# EasyEDA schematic SCH_SnailCard.json
TITLE: Sheet_1; REV: 1.0; Date: 2021-07-12; Sheet: 1/1; Drawn By: ftwtwzy; Company: Your Company
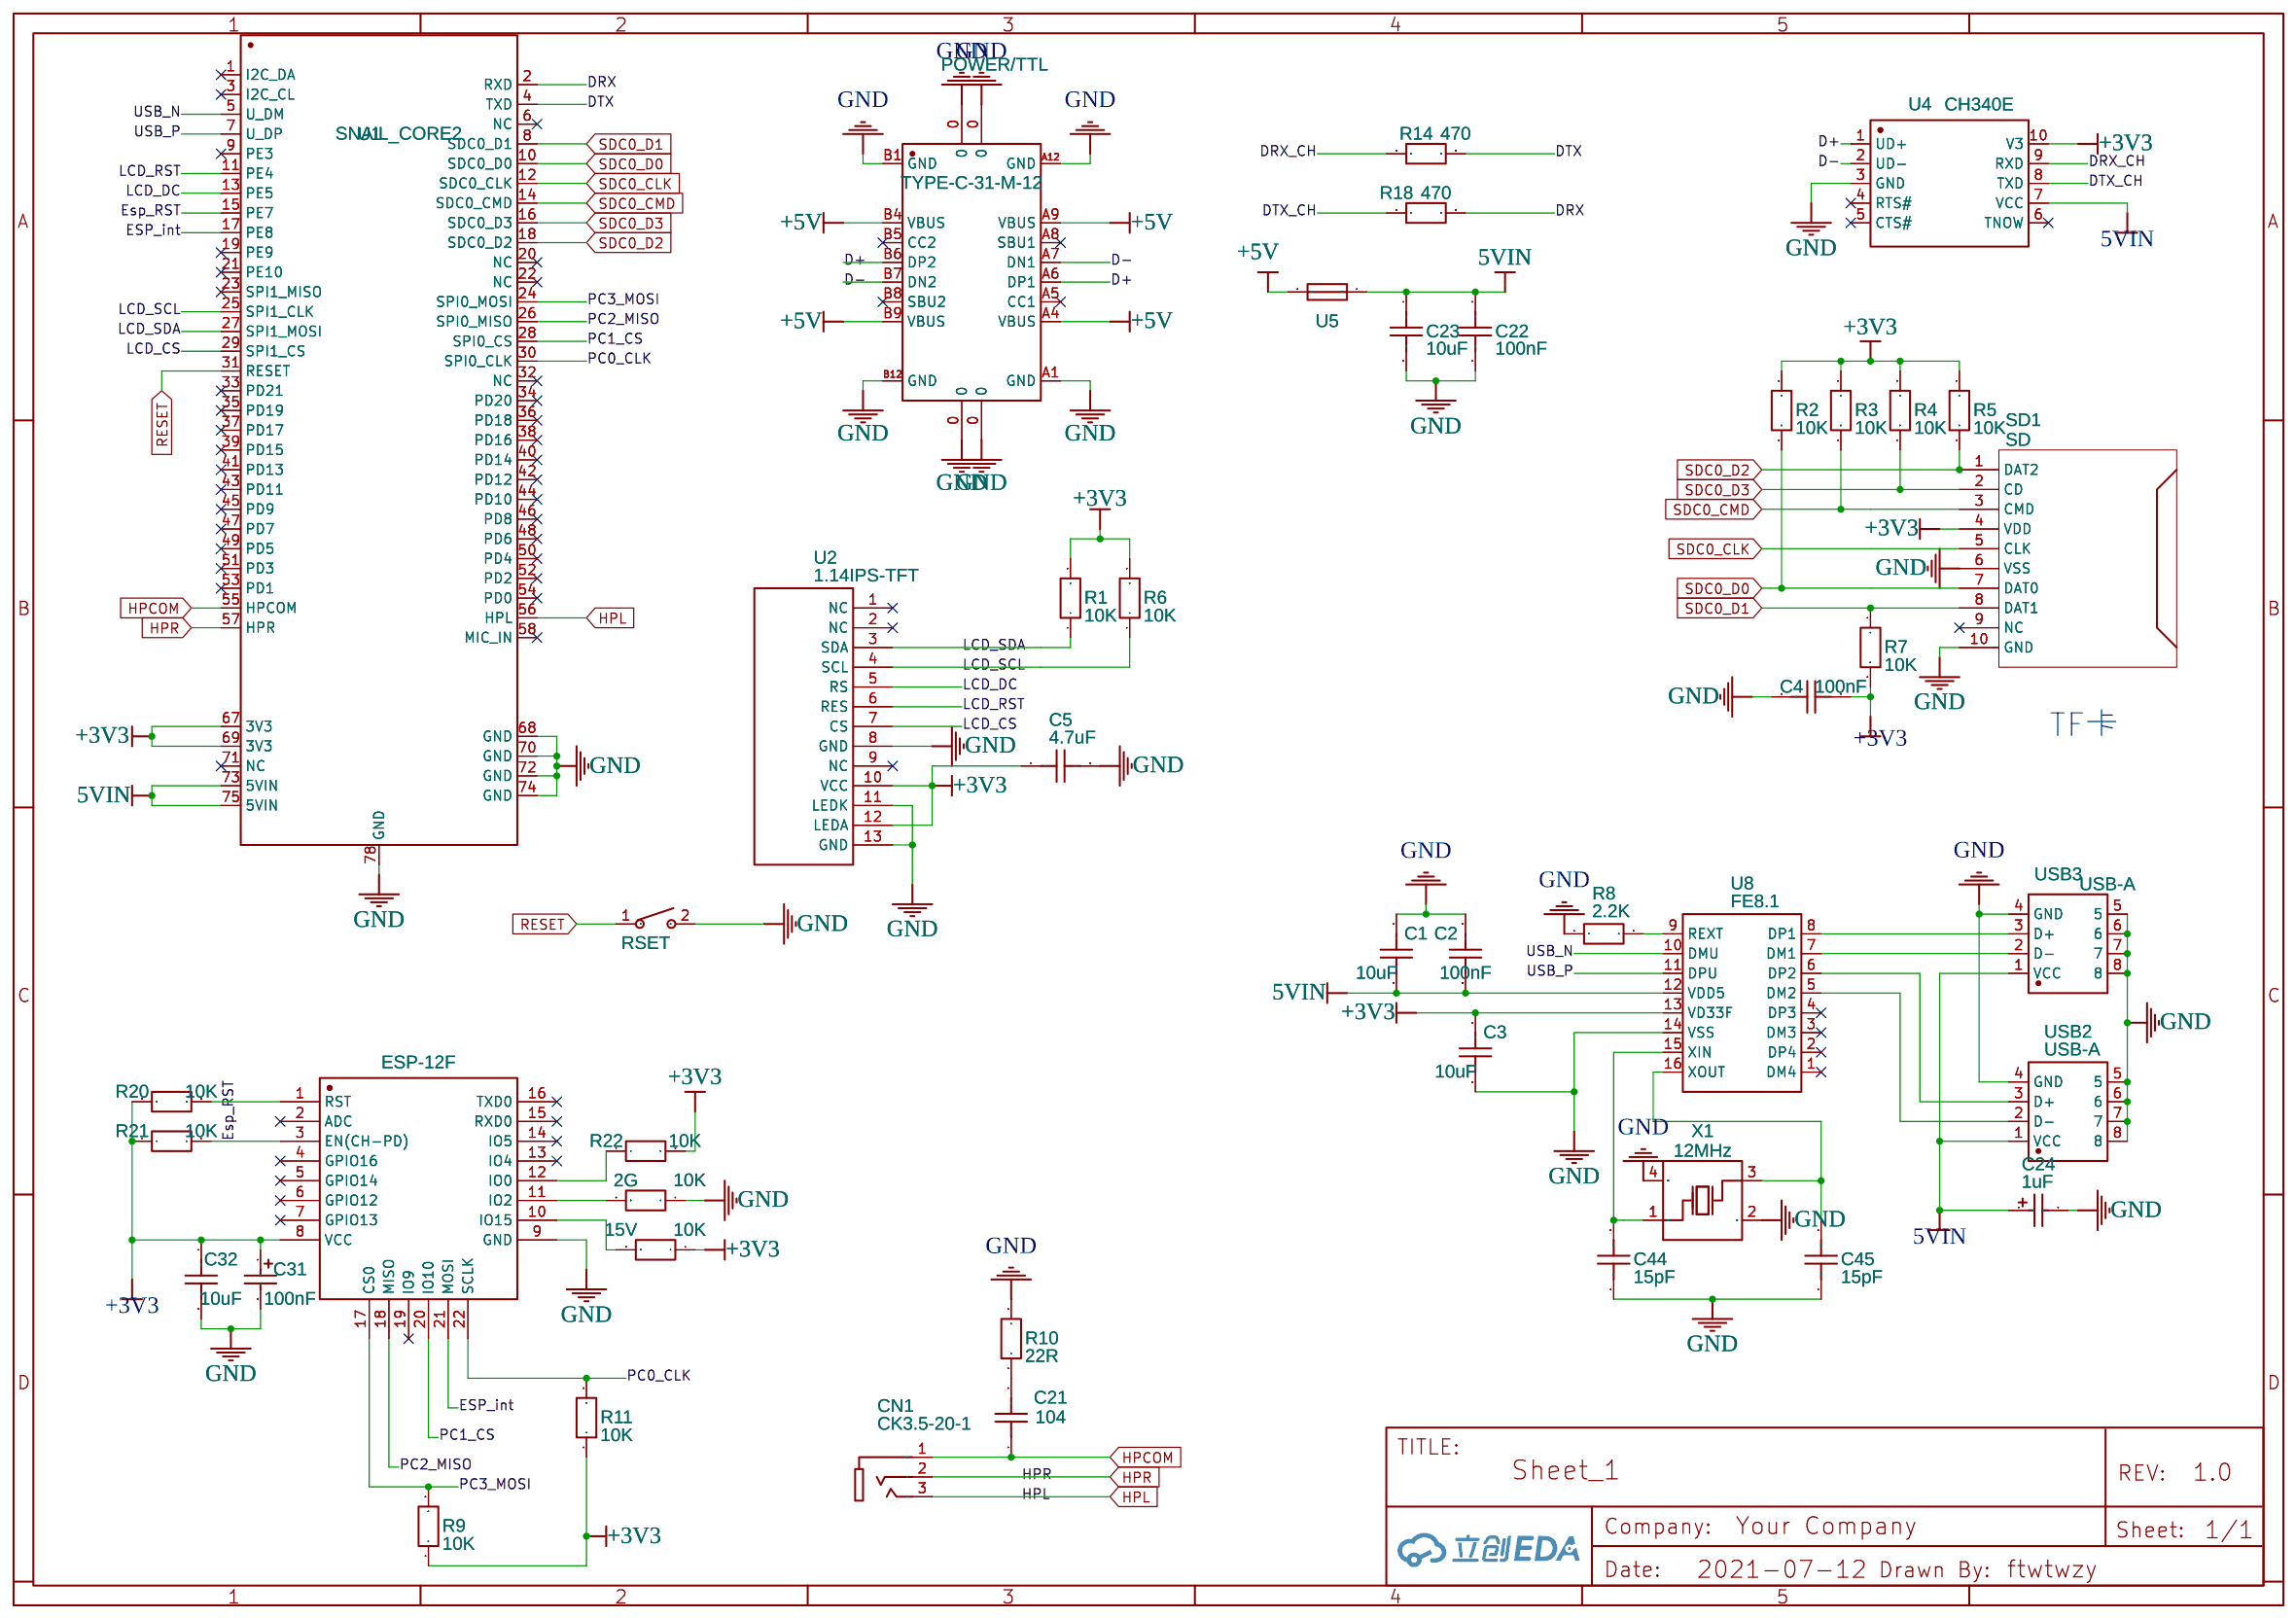
[diagram p0: schematic sheet]

## Parts
2G  10K  [R0603]
15V  10K  [R0603]
C1  10uF  [C0603]
C2  100nF  [C0603]
C3  10uF  [C0603]
C4  100nF  [C0603]
C5  4.7uF  [C0603]
C21  104  [C0603]
C22  100nF  [C0603]
C23  10uF  [C0603]
C24  1uF  [CAP-SMD_L3.5-W2.8-R-RD]
C31  100nF  [CAP-SMD_L3.5-W2.8-R-RD]
C32  10uF  [C0603]
C44  15pF  [C0603]
C45  15pF  [C0603]
CN1  CK3.5-20-1  [AUDIO-SMD_CK3.5-20-1]
POWER/TTL  TYPE-C-31-M-12  [USB-C_SMD-TYPE-C-31-M-12]
R1  10K  [R0603]
R2  10K  [R0603]
R3  10K  [R0603]
R4  10K  [R0603]
R5  10K  [R0603]
R6  10K  [R0603]
R7  10K  [R0603]
R8  2.2K  [R0603]
R9  10K  [R0603]
R10  22R  [R0603]
R11  10K  [R0603]
R14  470  [R0603]
R18  470  [R0603]
R20  10K  [R0603]
R21  10K  [R0603]
R22  10K  [R0603]
RSET  ST-1185S  [SW-SMD_ST-1185S]
SD1  SD  [TF-SMD_TF-115K]
U1  SNAIL_CORE2  [SNAIL_CORE2]
U2  1.14IPS-TFT  [1.14IPS]
U3  ESP-12F  [WIFIM-SMD_ESP-12F-ESP8266MOD]
U4  CH340E  [MSOP-10_L3.0-W3.0-P0.50-LS5.0-BL]
U5  TLC-NSMD005  [R1206]
U8  FE8.1  [SSOP-16_L4.9-W3.9-P0.64-LS6.0-BL]
USB2  USB-A  [USB-A]
USB3  USB-A  [USB-A]
X1  12MHz  [OSC-SMD_4P-L3.2-W2.5-BL]

## Library data of the parts
2G 15V R1-R9 R11 R14 R18 R20-R22 = ERA3ARB103V: Supplier: LCSC; Supplier Part: C465746; Manufacturer: PANASONIC; Contributor: LCSC; JLCPCB Part Class: Extended Part
C1-C5 C22 C23 C32 = AMK107BJ106MA-T: Supplier: LCSC; Supplier Part: C524952; Manufacturer: Taiyo Yuden; Contributor: LCSC
C21 C44 C45 = C_0603_US: Contributor: LCEDA_Lib
C24 C31 = TAJB105K035RNJ: Supplier: LCSC; Manufacturer: AVX; Supplier Part: C7192; SMT Type: Extend; JLCPCB SMD: Yes
CN1 = CK3.5-20-1: Supplier: LCSC; Supplier Part: C718046; Manufacturer: JINJIA; Contributor: LCSC
POWER/TTL = TYPE-C-31-M-12: Supplier: LCSC; Supplier Part: C165948; Manufacturer: Rectangular Connectors - Contacts; Contributor: LCSC
R10 = R_0603_EU: Contributor: LCEDA_Lib
RSET = ST-1185S: Supplier: LCSC; Supplier Part: C589191; Manufacturer: RI SHENG; Contributor: LCSC; JLCPCB Part Class: Extended Part
SD1 = SD: Contributor: 13058175081
U1 = SNAIL_CORE2: Contributor: ftwtwzy
U2 = 1.14IPS-TFT: Contributor: LiShanwenGit
U3 = ESP-12F(ESP8266MOD): Supplier: LCSC; Manufacturer: Ai-Thinker; Supplier Part: C82891
U4 = CH340E: Supplier: LCSC; Manufacturer: WCH; Supplier Part: C99652; LCSC Assembly: Yes; SMT Type: Extend
U5 = TLC-NSMD005: Supplier: LCSC; Supplier Part: C261946; Manufacturer: TLC Electronic; Contributor: LCSC; SMT Type: Extend; JLCPCB SMD: Yes
U8 = FE8.1: Manufacturer: terminus-usa; Manufacturer Part: FE8.1-FSOP16A; link: https://terminus-usa.com/product/fe8-1-usb2-0-high-speed-4-port-hub-controller/; Contributor: LiShanwenGit
USB2 USB3 = USB-A: Supplier: LCSC; Supplier Part: C42531; Manufacturer: LCSC; Manufacturer Part: USB-AF-SMD-12.8X10-H5.7; Contributor: ftwtwzy; JLCPCB Part Class: Extended Part
X1 = SMD-3225_4P27.12MHZ20PF10PPM-40&#126;+85℃: Supplier: LCSC; Supplier Part: C164053; Manufacturer: Zhejiang Abel Elec; Manufacturer Part: SMD-3225_4P27.12MHZ20PF10PPM-40~+85℃; Contributor: LCSC; SMT Type: Extend; JLCPCB SMD: Yes

## Nets
5VIN: C1.2 C2.2 C22.1 C23.1 C24.1 U1.73(5VIN) U1.75(5VIN) U4.7(VCC) U5.1 U8.12(VDD5) USB2.1(VCC) USB3.1(VCC)
+3V3: 15V.1 C3.1 C4.1 C5.1 C31.1 C32.1 R1.2 R2.1 R3.1 R4.1 R5.1 R6.2 R7.2 R9.1 R11.1 R20.1 R21.1 R22.2 SD1.4(VDD) U1.67(3V3) U1.69(3V3) U2.10(VCC) U2.12(LEDA) U3.8(VCC) U4.10(V3) U8.13(VD33F)
+5V: POWER/TTL.A4(VBUS) POWER/TTL.A9(VBUS) POWER/TTL.B4(VBUS) POWER/TTL.B9(VBUS) U5.2
GND: 2G.1 C1.1 C2.1 C3.2 C4.2 C5.2 C22.2 C23.2 C24.2 C31.2 C32.2 C44.1 C45.1 POWER/TTL.0 POWER/TTL.A1(GND) POWER/TTL.A12(GND) POWER/TTL.B1(GND) POWER/TTL.B12(GND) R8.1 R10.2 RSET.2 SD1.6(VSS) SD1.10(GND) U1.68(GND) U1.70(GND) U1.72(GND) U1.74(GND) U1.78(GND) U2.8(GND) U2.11(LEDK) U2.13(GND) U3.9(GND) U4.3(GND) U8.14(VSS) USB2.4(GND) USB2.5 USB2.6 USB2.7 USB2.8 USB3.4(GND) USB3.5 USB3.6 USB3.7 USB3.8 X1.2(GND) X1.4(GND)
D+: POWER/TTL.A6(DP1) POWER/TTL.B6(DP2) U4.1(UD+)
D-: POWER/TTL.A7(DN1) POWER/TTL.B7(DN2) U4.2(UD-)
DRX: R18.2 U1.2(RXD)
DRX_CH: R14.1 U4.9(RXD)
DTX: R14.2 U1.4(TXD)
DTX_CH: R18.1 U4.8(TXD)
ESP_int: U1.17(PE8) U3.21(MOSI)
Esp_RST: R21.2 U1.15(PE7) U3.3(EN(CH-PD))
HPCOM: C21.1 CN1.1 U1.55(HPCOM)
HPL: CN1.3 U1.56(HPL)
HPR: CN1.2 U1.57(HPR)
LCD_CS: U1.29(SPI1_CS) U2.7(CS)
LCD_DC: U1.13(PE5) U2.5(RS)
LCD_RST: U1.11(PE4) U2.6(RES)
LCD_SCL: R6.1 U1.25(SPI1_CLK) U2.4(SCL)
LCD_SDA: R1.1 U1.27(SPI1_MOSI) U2.3(SDA)
PC0_CLK: R11.2 U1.30(SPI0_CLK) U3.22(SCLK)
PC1_CS: U1.28(SPI0_CS) U3.20(IO10)
PC2_MISO: U1.26(SPI0_MISO) U3.18(MISO)
PC3_MOSI: R9.2 U1.24(SPI0_MOSI) U3.17(CS0)
RESET: RSET.1 U1.31(RESET)
SDC0_CLK: SD1.5(CLK) U1.12(SDC0_CLK)
SDC0_CMD: R3.2 SD1.3(CMD) U1.14(SDC0_CMD)
SDC0_D0: R2.2 SD1.7(DAT0) U1.10(SDC0_D0)
SDC0_D1: R7.1 SD1.8(DAT1) U1.8(SDC0_D1)
SDC0_D2: R5.2 SD1.1(DAT2) U1.18(SDC0_D2)
SDC0_D3: R4.2 SD1.2(CD) U1.16(SDC0_D3)
USB_N: U1.5(U_DM) U8.10(DMU)
USB_P: U1.7(U_DP) U8.11(DPU)
Net-(2G-2): 2G.2 U3.11(IO2)
Net-(15V-2): 15V.2 U3.10(IO15)
Net-(C21-2): C21.2 R10.1
Net-(C44-2): C44.2 U8.15(XIN) X1.1(OSC1)
Net-(C45-2): C45.2 U8.16(XOUT) X1.3(OSC2)
Net-(R8-2): R8.2 U8.9(REXT)
Net-(R20-2): R20.2 U3.1(RST)
Net-(R22-1): R22.1 U3.12(IO0)
Net-(U8-5): U8.5(DM2) USB2.2(D-)
Net-(U8-6): U8.6(DP2) USB2.3(D+)
Net-(U8-7): U8.7(DM1) USB3.2(D-)
Net-(U8-8): U8.8(DP1) USB3.3(D+)

Not connected (* = marked no-connect by the designer): POWER/TTL A5(CC1)* A8(SBU1)* B5(CC2)* B8(SBU2)*; SD1 9(NC)*; U1 1(I2C_DA)* 3(I2C_CL)* 6(NC)* 9(PE3)* 19(PE9)* 20(NC)* 21(PE10)* 22(NC)* 23(SPI1_MISO)* 32(NC)* 33(PD21)* 34(PD20)* 35(PD19)* 36(PD18)* 37(PD17)* 38(PD16)* 39(PD15)* 40(PD14)* 41(PD13)* 42(PD12)* 43(PD11)* 44(PD10)* 45(PD9)* 46(PD8)* 47(PD7)* 48(PD6)* 49(PD5)* 50(PD4)* 51(PD3)* 52(PD2)* 53(PD1)* 54(PD0)* 58(MIC_IN)* 71(NC)*; U2 1(NC)* 2(NC)* 9(NC)*; U3 2(ADC)* 4(GPIO16)* 5(GPIO14)* 6(GPIO12)* 7(GPIO13)* 13(IO4)* 14(IO5)* 15(RXD0)* 16(TXD0)* 19(IO9)*; U4 4(RTS#)* 5(CTS#)* 6(TNOW)*; U8 1(DM4)* 2(DP4)* 3(DM3)* 4(DP3)*

## Notes on the sheet
- TF卡
